# Altium schematic sheet Encoder NPN.SchDoc
size A4
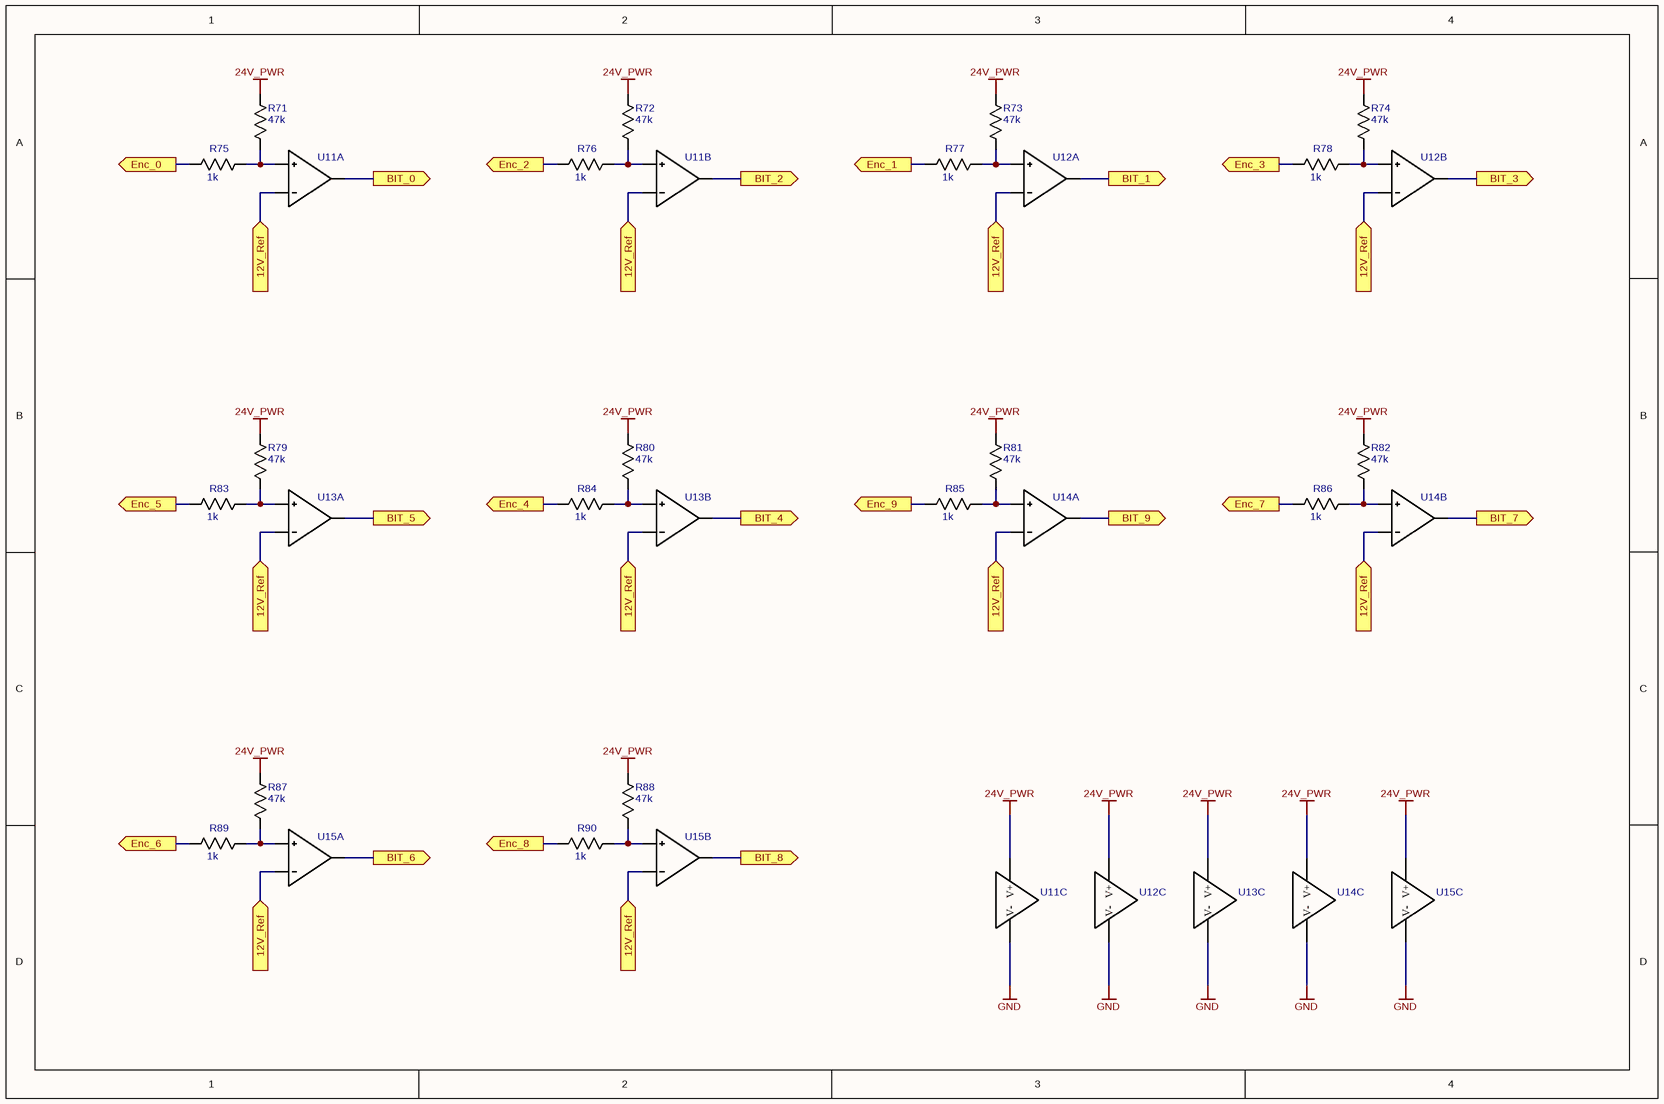
[diagram p0: Encoder NPN.SchDoc]

## Parts
R71  47k  [RES 0603]
R72  47k  [RES 0603]
R73  47k  [RES 0603]
R74  47k  [RES 0603]
R75  1k  [RES 0603]
R76  1k  [RES 0603]
R77  1k  [RES 0603]
R78  1k  [RES 0603]
R79  47k  [RES 0603]
R80  47k  [RES 0603]
R81  47k  [RES 0603]
R82  47k  [RES 0603]
R83  1k  [RES 0603]
R84  1k  [RES 0603]
R85  1k  [RES 0603]
R86  1k  [RES 0603]
R87  47k  [RES 0603]
R88  47k  [RES 0603]
R89  1k  [RES 0603]
R90  1k  [RES 0603]
U11  Comparator x2 Small  [SOIC-8]  (value not drawn)  (parts A,B,C of 3)
U12  Comparator x2 Small  (value not drawn)  (parts A,B,C of 3)
U13  Comparator x2 Small  [SOIC-8]  (value not drawn)  (parts A,B,C of 3)
U14  Comparator x2 Small  [SOIC-8]  (value not drawn)  (parts A,B,C of 3)
U15  Comparator x2 Small  (value not drawn)  (parts A,B,C of 3)

## Ports
12V_Ref, BIT_0, BIT_1, BIT_2, BIT_3, BIT_4, BIT_5, BIT_6, BIT_7, BIT_8, BIT_9, Enc_0, Enc_1, Enc_2, Enc_3, Enc_4, Enc_5, Enc_6, Enc_7, Enc_8, Enc_9

## Nets
24V_PWR: R71.2 R72.2 R73.2 R74.2 R79.2 R80.2 R81.2 R82.2 R87.2 R88.2 U11.7(V+) U12.7(V+) U13.7(V+) U14.7(V+) U15.7(V+)
GND: U11.8(V-) U12.8(V-) U13.8(V-) U14.8(V-) U15.8(V-)
12V_Ref: U11.2(-IN) U11.5(-IN) U12.2(-IN) U12.5(-IN) U13.2(-IN) U13.5(-IN) U14.2(-IN) U14.5(-IN) U15.2(-IN) U15.5(-IN) ; port 12V_Ref
BIT_0: U11.3(OUT) ; port BIT_0
BIT_1: U12.3(OUT) ; port BIT_1
BIT_2: U11.6(OUT) ; port BIT_2
BIT_3: U12.6(OUT) ; port BIT_3
BIT_4: U13.6(OUT) ; port BIT_4
BIT_5: U13.3(OUT) ; port BIT_5
BIT_6: U15.3(OUT) ; port BIT_6
BIT_7: U14.6(OUT) ; port BIT_7
BIT_8: U15.6(OUT) ; port BIT_8
BIT_9: U14.3(OUT) ; port BIT_9
Enc_0: R75.2 ; port Enc_0
Enc_1: R77.2 ; port Enc_1
Enc_2: R76.2 ; port Enc_2
Enc_3: R78.2 ; port Enc_3
Enc_4: R84.2 ; port Enc_4
Enc_5: R83.2 ; port Enc_5
Enc_6: R89.2 ; port Enc_6
Enc_7: R86.2 ; port Enc_7
Enc_8: R90.2 ; port Enc_8
Enc_9: R85.2 ; port Enc_9
NetR71_1: R71.1 R75.1 U11.1(+IN)
NetR72_1: R72.1 R76.1 U11.4(+IN)
NetR73_1: R73.1 R77.1 U12.1(+IN)
NetR74_1: R74.1 R78.1 U12.4(+IN)
NetR79_1: R79.1 R83.1 U13.1(+IN)
NetR80_1: R80.1 R84.1 U13.4(+IN)
NetR81_1: R81.1 R85.1 U14.1(+IN)
NetR82_1: R82.1 R86.1 U14.4(+IN)
NetR87_1: R87.1 R89.1 U15.1(+IN)
NetR88_1: R88.1 R90.1 U15.4(+IN)

## Library data of the parts
R71-R74 R79-R82 R87 R88 = Resistor: RC0603FR-0747KL
R75-R78 R83-R86 R89 R90 = Resistor: RC0603FR-071KL
U11 = Comparator x2 Small: LM2903; pin to pad: 1>3 3>1 4>5 5>6 6>7 7>8 8>4
U12-U15 = Comparator x2 Small: LM2903